# EAGLE design pdip shield (EAGLE 5.06)
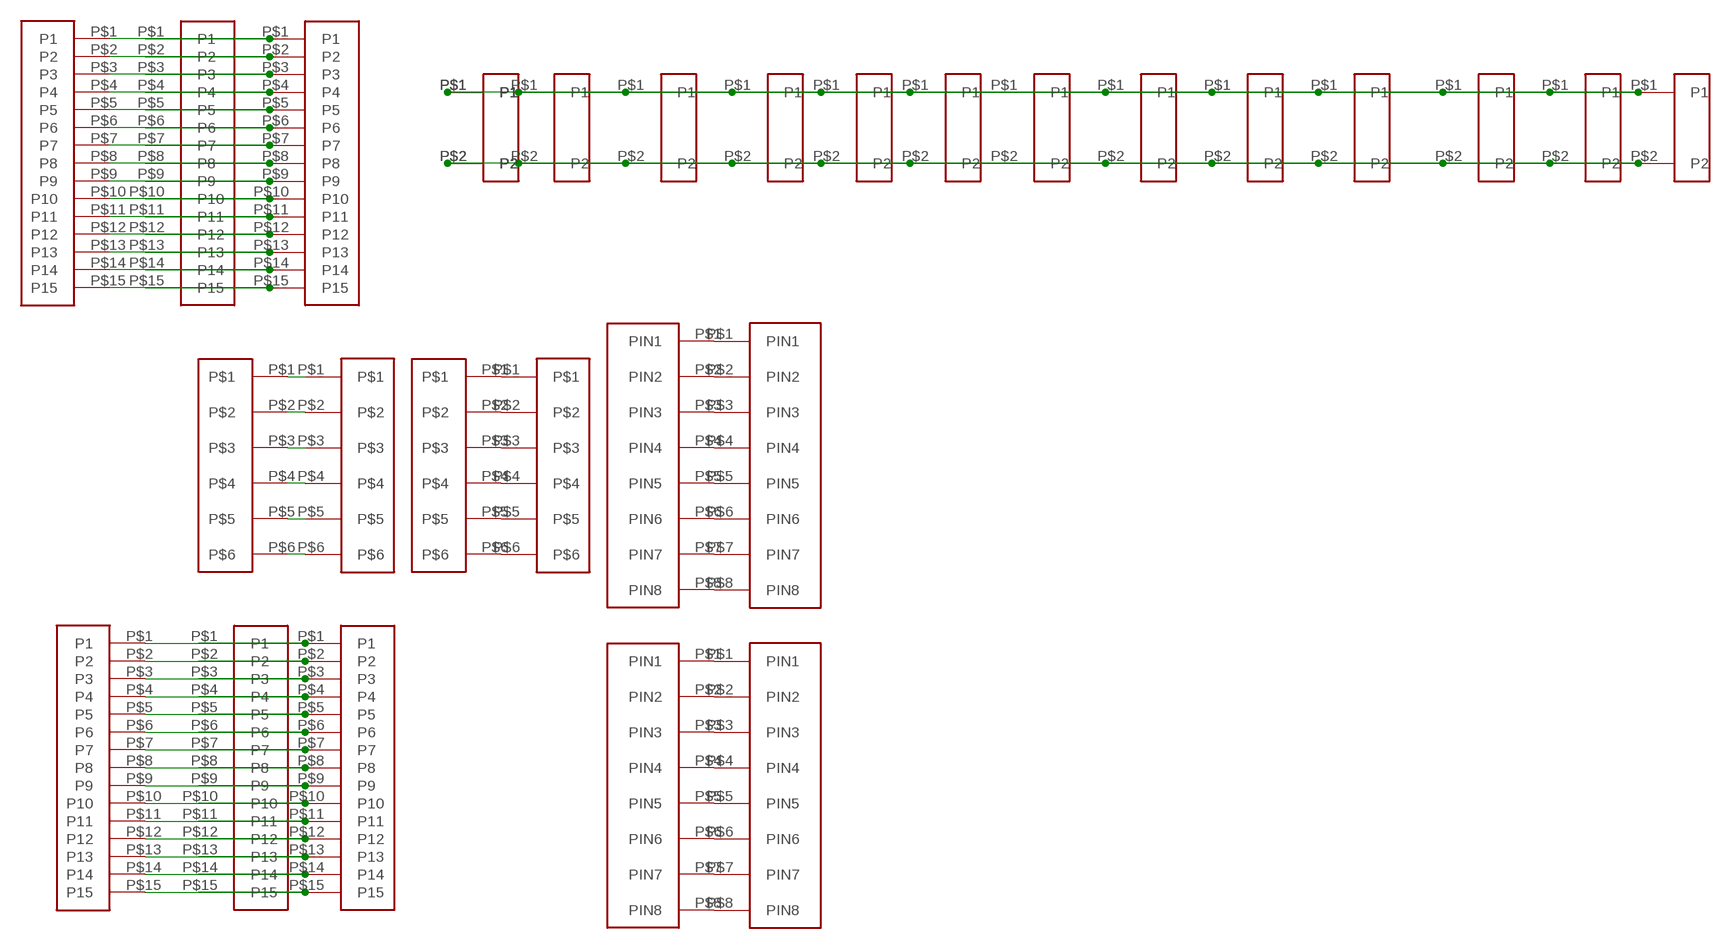
[diagram p0: schematic, sheet 1]

## Parts
U$1  6PIN_GROUP  [6PIN_GROUP]
U$2  6PIN_GROUP  [6PIN_GROUP]
U$3  6PIN_GROUP  [6PIN_GROUP]
U$4  6PIN_GROUP  [6PIN_GROUP]
U$5  8PIN_GROUP  [8PIN_GROUP]
U$6  8PIN_GROUP  [8PIN_GROUP]
U$7  8PIN_GROUP  [8PIN_GROUP]
U$8  8PIN_GROUP  [8PIN_GROUP]
U$9  15PIN_GROUP  [15PIN_GROUP]
U$10  15PIN_GROUP  [15PIN_GROUP]
U$11  15PIN_GROUP  [15PIN_GROUP]
U$12  15PIN_GROUP  [15PIN_GROUP]
U$13  15PIN_GROUP  [15PIN_GROUP]
U$14  15PIN_GROUP  [15PIN_GROUP]
U$15  2PIN_GROUP  [2PIN_GROUP]
U$16  2PIN_GROUP  [2PIN_GROUP]
U$17  2PIN_GROUP  [2PIN_GROUP]
U$18  2PIN_GROUP  [2PIN_GROUP]
U$19  2PIN_GROUP  [2PIN_GROUP]
U$20  2PIN_GROUP  [2PIN_GROUP]
U$21  2PIN_GROUP  [2PIN_GROUP]
U$22  2PIN_GROUP  [2PIN_GROUP]
U$23  2PIN_GROUP  [2PIN_GROUP]
U$24  2PIN_GROUP  [2PIN_GROUP]
U$25  2PIN_GROUP  [2PIN_GROUP]
U$26  2PIN_GROUP  [2PIN_GROUP]
U$27  2PIN_GROUP  [2PIN_GROUP]
U$28  2PIN_GROUP  [2PIN_GROUP]
U$29  2PIN_GROUP  [2PIN_GROUP]

## Nets
N$1: U$1.P$1 U$2.P$1
N$2: U$1.P$2 U$2.P$2
N$3: U$1.P$3 U$2.P$3
N$4: U$1.P$4 U$2.P$4
N$5: U$1.P$5 U$2.P$5
N$6: U$1.P$6 U$2.P$6
N$7: U$5.P$1(PIN1) U$6.P$1(PIN1)
N$8: U$5.P$2(PIN2) U$6.P$2(PIN2)
N$9: U$5.P$3(PIN3) U$6.P$3(PIN3)
N$10: U$5.P$4(PIN4) U$6.P$4(PIN4)
N$11: U$5.P$5(PIN5) U$6.P$5(PIN5)
N$12: U$5.P$6(PIN6) U$6.P$6(PIN6)
N$13: U$5.P$7(PIN7) U$6.P$7(PIN7)
N$14: U$5.P$8(PIN8) U$6.P$8(PIN8)
N$15: U$7.P$1(PIN1) U$8.P$1(PIN1)
N$16: U$7.P$2(PIN2) U$8.P$2(PIN2)
N$17: U$7.P$3(PIN3) U$8.P$3(PIN3)
N$18: U$7.P$4(PIN4) U$8.P$4(PIN4)
N$19: U$7.P$5(PIN5) U$8.P$5(PIN5)
N$20: U$7.P$6(PIN6) U$8.P$6(PIN6)
N$21: U$7.P$7(PIN7) U$8.P$7(PIN7)
N$22: U$7.P$8(PIN8) U$8.P$8(PIN8)
N$23: U$3.P$1 U$4.P$1
N$24: U$3.P$2 U$4.P$2
N$25: U$3.P$3 U$4.P$3
N$26: U$3.P$4 U$4.P$4
N$27: U$3.P$5 U$4.P$5
N$28: U$3.P$6 U$4.P$6
N$30: U$9.P$1(P1) U$10.P$1(P1) U$11.P$1(P1)
N$31: U$9.P$2(P2) U$10.P$2(P2) U$11.P$2(P2)
N$32: U$9.P$3(P3) U$10.P$3(P3) U$11.P$3(P3)
N$33: U$9.P$4(P4) U$10.P$4(P4) U$11.P$4(P4)
N$34: U$9.P$5(P5) U$10.P$5(P5) U$11.P$5(P5)
N$35: U$9.P$6(P6) U$10.P$6(P6) U$11.P$6(P6)
N$36: U$9.P$7(P7) U$10.P$7(P7) U$11.P$7(P7)
N$37: U$9.P$8(P8) U$10.P$8(P8) U$11.P$8(P8)
N$38: U$9.P$9(P9) U$10.P$9(P9) U$11.P$9(P9)
N$39: U$9.P$10(P10) U$10.P$10(P10) U$11.P$10(P10)
N$40: U$9.P$11(P11) U$10.P$11(P11) U$11.P$11(P11)
N$41: U$9.P$12(P12) U$10.P$12(P12) U$11.P$12(P12)
N$42: U$9.P$13(P13) U$10.P$13(P13) U$11.P$13(P13)
N$43: U$9.P$14(P14) U$10.P$14(P14) U$11.P$14(P14)
N$44: U$9.P$15(P15) U$10.P$15(P15) U$11.P$15(P15)
N$45: U$12.P$1(P1) U$13.P$1(P1) U$14.P$1(P1)
N$46: U$12.P$2(P2) U$13.P$2(P2) U$14.P$2(P2)
N$47: U$12.P$3(P3) U$13.P$3(P3) U$14.P$3(P3)
N$48: U$12.P$4(P4) U$13.P$4(P4) U$14.P$4(P4)
N$49: U$12.P$5(P5) U$13.P$5(P5) U$14.P$5(P5)
N$50: U$12.P$6(P6) U$13.P$6(P6) U$14.P$6(P6)
N$51: U$12.P$7(P7) U$13.P$7(P7) U$14.P$7(P7)
N$52: U$12.P$8(P8) U$13.P$8(P8) U$14.P$8(P8)
N$53: U$12.P$9(P9) U$13.P$9(P9) U$14.P$9(P9)
N$54: U$12.P$10(P10) U$13.P$10(P10) U$14.P$10(P10)
N$55: U$12.P$11(P11) U$13.P$11(P11) U$14.P$11(P11)
N$56: U$12.P$12(P12) U$13.P$12(P12) U$14.P$12(P12)
N$57: U$12.P$13(P13) U$13.P$13(P13) U$14.P$13(P13)
N$58: U$12.P$14(P14) U$13.P$14(P14) U$14.P$14(P14)
N$59: U$12.P$15(P15) U$13.P$15(P15) U$14.P$15(P15)
N$60: U$15.P$1(P1) U$16.P$1(P1) U$17.P$1(P1) U$18.P$1(P1) U$19.P$1(P1) U$20.P$1(P1) U$21.P$1(P1) U$22.P$1(P1) U$23.P$1(P1) U$24.P$1(P1) U$25.P$1(P1) U$26.P$1(P1) U$27.P$1(P1) U$28.P$1(P1) U$29.P$1(P1)
N$61: U$15.P$2(P2) U$16.P$2(P2) U$17.P$2(P2) U$18.P$2(P2) U$19.P$2(P2) U$20.P$2(P2) U$21.P$2(P2) U$22.P$2(P2) U$23.P$2(P2) U$24.P$2(P2) U$25.P$2(P2) U$26.P$2(P2) U$27.P$2(P2) U$28.P$2(P2) U$29.P$2(P2)

## Library data of the parts
U$1-U$4 = edebill:6PIN_GROUP
U$5-U$8 = edebill:8PIN_GROUP
U$9-U$14 = edebill:15PIN_GROUP
U$15-U$29 = edebill:2PIN_GROUP

## Board
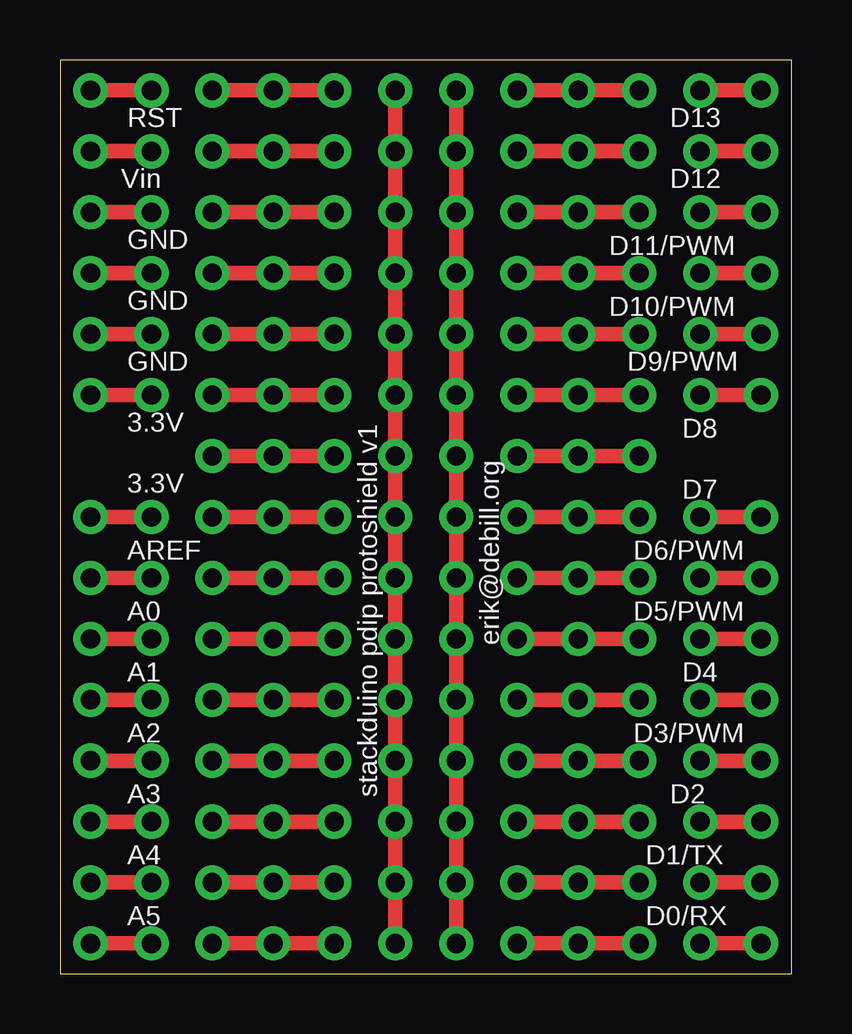
[diagram p1: board, top side]

Size 30.48 x 38.1 mm. Coordinates in mm from the lower left corner, seen from the top.
Outline: 0,38.1 0,0 30.48,0 30.48,38.1 0,38.1
Copper layers (1*16): Top 0.035mm / dielectric 1.5mm / Bottom 0.035mm
Design rules "default *": minimum track width 24mil, minimum drill 24mil, track to track 8mil, track to pad 8mil, pad to pad 8mil, via to via 8mil, smd to smd 8mil, copper to edge 40mil, drill to drill 8mil, minimum pad ring 10mil, minimum via ring 8mil, stop-mask expansion 4mil, vias tented up to drill 0mil, thermal gap 10mil

### Footprints (pad centres in the part's own frame; a part is rotated, then mirrored left to right if it is on the bottom)
6PIN_GROUP = drill 0.8 pad 1.422 round: P$1 0,1.27; P$2 0,3.81; P$3 0,6.35; P$4 0,-1.27; P$5 0,-3.81; P$6 0,-6.35
8PIN_GROUP = drill 0.8 pad 1.422 round: P$1 0,1.27; P$2 0,3.81; P$3 0,6.35; P$4 0,8.89; P$5 0,-1.27; P$6 0,-3.81; P$7 0,-6.35; P$8 0,-8.89
15PIN_GROUP = drill 0.8 pad 1.422 round: P$1 0,10.16; P$2 0,7.62; P$3 0,5.08; P$4 0,2.54; P$5 0,0; P$6 0,-2.54; P$7 0,-5.08; P$8 0,-7.62; P$9 0,-10.16; P$10 0,12.7; P$11 0,15.24; P$12 0,17.78; P$13 0,-12.7; P$14 0,-15.24; P$15 0,-17.78
2PIN_GROUP = drill 0.8 pad 1.422 round: P$1 0,1.27; P$2 0,-1.27

### Placement (x,y rotation side)
U$1  1.27,30.48 0 top
U$2  3.81,30.48 0 top
U$3  29.21,30.48 0 top
U$4  26.67,30.48 0 top
U$5  29.21,10.16 0 top
U$6  26.67,10.16 0 top
U$7  3.81,10.16 0 top
U$8  1.27,10.16 0 top
U$9  24.13,19.05 0 top
U$10  21.59,19.05 0 top
U$11  19.05,19.05 0 top
U$12  11.43,19.05 0 top
U$13  8.89,19.05 0 top
U$14  6.35,19.05 0 top
U$15  15.24,1.27 90 top
U$16  15.24,3.81 90 top
U$17  15.24,6.35 90 top
U$18  15.24,8.89 90 top
U$19  15.24,11.43 90 top
U$20  15.24,13.97 90 top
U$21  15.24,16.51 90 top
U$22  15.24,19.05 90 top
U$23  15.24,21.59 90 top
U$24  15.24,24.13 90 top
U$25  15.24,26.67 90 top
U$26  15.24,29.21 90 top
U$27  15.24,31.75 90 top
U$28  15.24,34.29 90 top
U$29  15.24,36.83 90 top

### Tracks (layer width: path | path; a pad name or v marks a point on that pad's centre or on a via)
N$1
  Top 0.61: U$1.P$1 U$2.P$1
N$2
  Top 0.61: U$1.P$2 U$2.P$2
N$3
  Top 0.61: U$1.P$3 U$2.P$3
N$4
  Top 0.61: U$1.P$4 U$2.P$4
N$5
  Top 0.61: U$1.P$5 U$2.P$5
N$6
  Top 0.61: U$1.P$6 U$2.P$6
N$7
  Top 0.61: U$6.P$1 U$5.P$1
N$8
  Top 0.61: U$6.P$2 U$5.P$2
N$9
  Top 0.61: U$6.P$3 U$5.P$3
N$10
  Top 0.61: U$6.P$4 U$5.P$4
N$11
  Top 0.61: U$6.P$5 U$5.P$5
N$12
  Top 0.61: U$6.P$6 U$5.P$6
N$13
  Top 0.61: U$6.P$7 U$5.P$7
N$14
  Top 0.61: U$6.P$8 U$5.P$8
N$15
  Top 0.61: U$8.P$1 U$7.P$1
N$16
  Top 0.61: U$8.P$2 U$7.P$2
N$17
  Top 0.61: U$8.P$3 U$7.P$3
N$18
  Top 0.61: U$8.P$4 U$7.P$4
N$19
  Top 0.61: U$8.P$5 U$7.P$5
N$20
  Top 0.61: U$8.P$6 U$7.P$6
N$21
  Top 0.61: U$8.P$7 U$7.P$7
N$22
  Top 0.61: U$8.P$8 U$7.P$8
N$23
  Top 0.61: U$4.P$1 U$3.P$1
N$24
  Top 0.61: U$4.P$2 U$3.P$2
N$25
  Top 0.61: U$4.P$3 U$3.P$3
N$26
  Top 0.61: U$4.P$4 U$3.P$4
N$27
  Top 0.61: U$4.P$5 U$3.P$5
N$28
  Top 0.61: U$4.P$6 U$3.P$6
N$30
  Top 0.61: U$11.P$1 U$10.P$1 U$9.P$1
N$31
  Top 0.61: U$11.P$2 U$10.P$2 U$9.P$2
N$32
  Top 0.61: U$11.P$3 U$10.P$3 U$9.P$3
N$33
  Top 0.61: U$11.P$4 U$10.P$4 U$9.P$4
N$34
  Top 0.61: U$11.P$5 U$10.P$5 U$9.P$5
N$35
  Top 0.61: U$11.P$6 U$10.P$6 U$9.P$6
N$36
  Top 0.61: U$11.P$7 U$10.P$7 U$9.P$7
N$37
  Top 0.61: U$11.P$8 U$10.P$8 U$9.P$8
N$38
  Top 0.61: U$11.P$9 U$10.P$9 U$9.P$9
N$39
  Top 0.61: U$11.P$10 U$10.P$10 U$9.P$10
N$40
  Top 0.61: U$11.P$11 U$10.P$11 U$9.P$11
N$41
  Top 0.61: U$11.P$12 U$10.P$12 U$9.P$12
N$42
  Top 0.61: U$11.P$13 U$10.P$13 U$9.P$13
N$43
  Top 0.61: U$11.P$14 U$10.P$14 U$9.P$14
N$44
  Top 0.61: U$11.P$15 U$10.P$15 U$9.P$15
N$45
  Top 0.61: U$14.P$1 U$13.P$1 U$12.P$1
N$46
  Top 0.61: U$14.P$2 U$13.P$2 U$12.P$2
N$47
  Top 0.61: U$14.P$3 U$13.P$3 U$12.P$3
N$48
  Top 0.61: U$14.P$4 U$13.P$4 U$12.P$4
N$49
  Top 0.61: U$14.P$5 U$13.P$5 U$12.P$5
N$50
  Top 0.61: U$14.P$6 U$13.P$6 U$12.P$6
N$51
  Top 0.61: U$14.P$7 U$13.P$7 U$12.P$7
N$52
  Top 0.61: U$14.P$8 U$13.P$8 U$12.P$8
N$53
  Top 0.61: U$14.P$9 U$13.P$9 U$12.P$9
N$54
  Top 0.61: U$14.P$10 U$13.P$10 U$12.P$10
N$55
  Top 0.61: U$14.P$11 U$13.P$11 U$12.P$11
N$56
  Top 0.61: U$14.P$12 U$13.P$12 U$12.P$12
N$57
  Top 0.61: U$14.P$13 U$13.P$13 U$12.P$13
N$58
  Top 0.61: U$14.P$14 U$13.P$14 U$12.P$14
N$59
  Top 0.61: U$14.P$15 U$13.P$15 U$12.P$15
N$60
  Top 0.61: U$15.P$1 U$16.P$1 U$17.P$1 U$18.P$1 U$19.P$1 U$20.P$1 U$21.P$1 U$22.P$1 U$23.P$1 U$24.P$1 U$25.P$1 U$26.P$1 U$27.P$1 U$28.P$1 U$29.P$1
N$61
  Top 0.61: U$15.P$2 U$16.P$2 U$17.P$2 U$18.P$2 U$19.P$2 U$20.P$2 U$21.P$2 U$22.P$2 U$23.P$2 U$24.P$2 U$25.P$2 U$26.P$2 U$27.P$2 U$28.P$2 U$29.P$2

### Text on the board
tPlace: RST | D13 | Vin | D12 | GND | D11/PWM | GND | D10/PWM | GND | D9/PWM | 3.3V | D8 | 3.3V | D7 | AREF | D6/PWM | A0 | D5/PWM | erik@debill.org | A1 | D4 | A2 | D3/PWM | A3 | stackduino pdip protoshield v1 | D2 | A4 | D1/TX | A5 | D0/RX